# EasyEDA Pro project ProPrj_辅助电源_2024-09-12.epro

# Schematic Schematic1
Board Name: Board1; Create Date: 2024-09-10
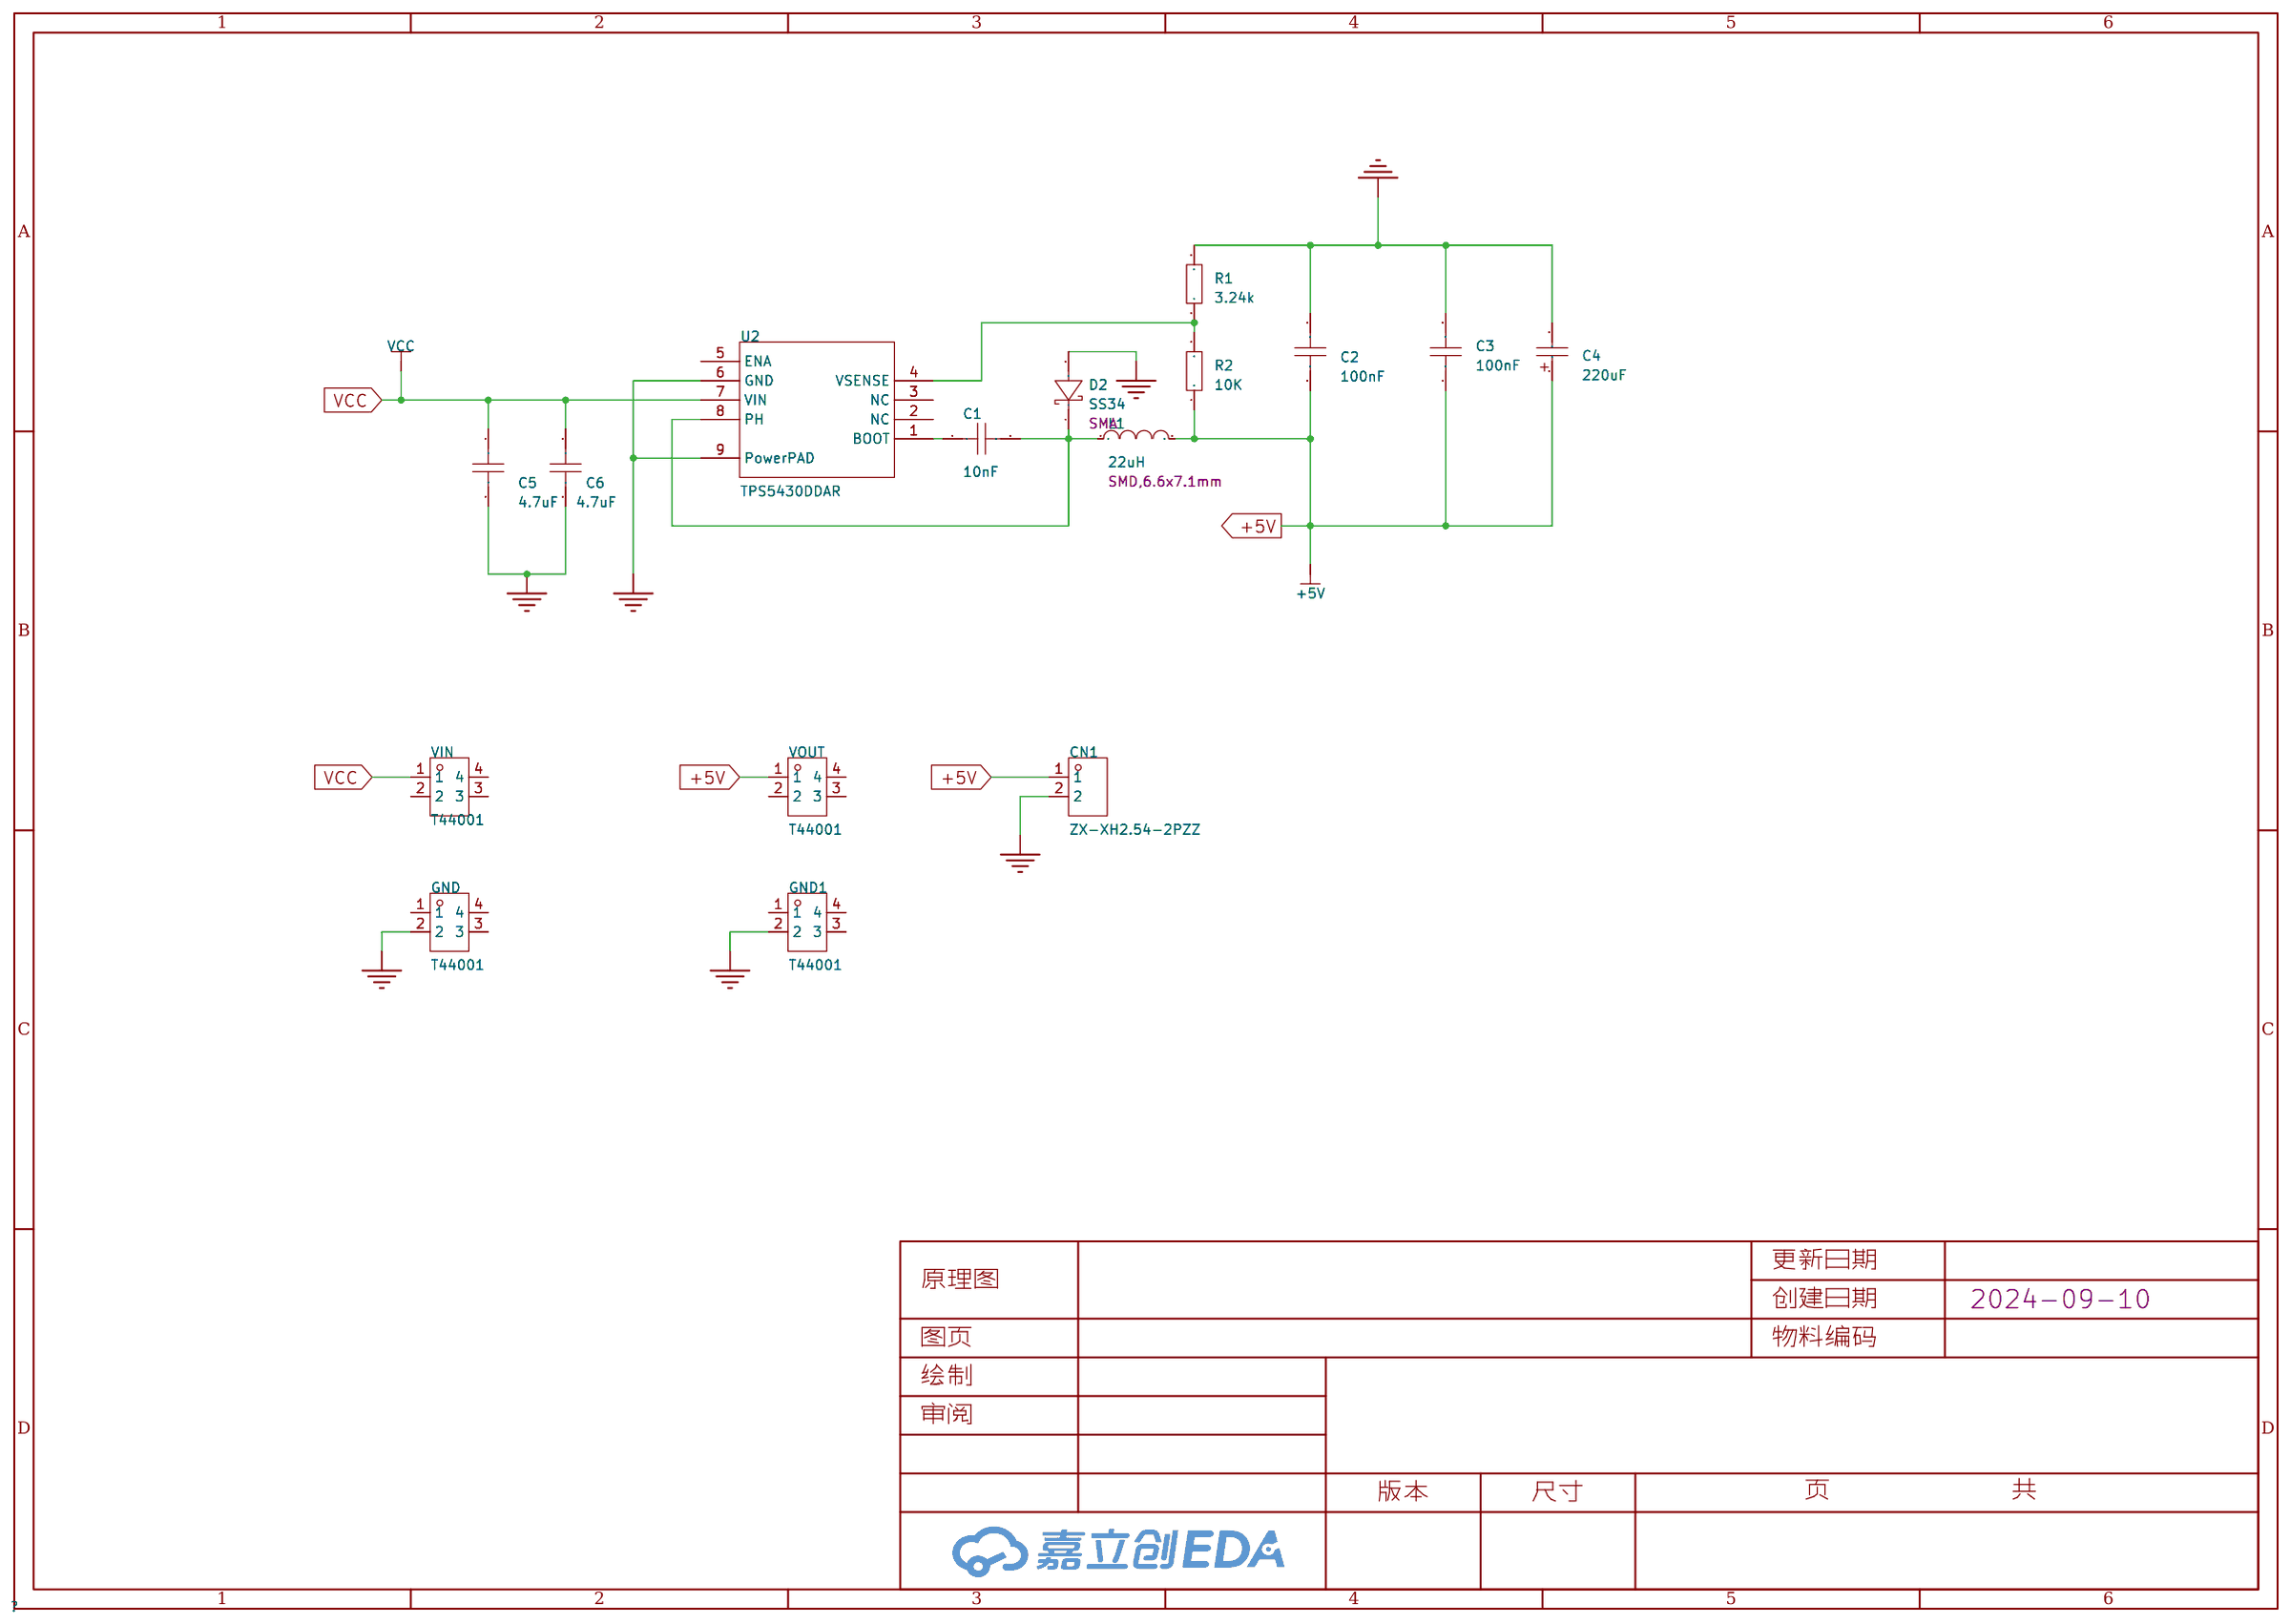
[diagram p0: schematic sheet]

## Parts
C1  10nF  [C0603]
C2  100nF  [C0603]
C3  100nF  [C0603]
C4  220uF  [C_Ele_SMD_3x5.4mm]
C5  4.7uF  [C0603]
C6  4.7uF  [C0603]
CN1  ZX-XH2.54-2PZZ  [CONN-TH_2P-P2.50_HX25003-2A]
D2  SS34  [SMA_L4.3-W2.7-LS5.0-RD]
GND  T44001  [CONN-TH_T44001]
GND1  T44001  [CONN-TH_T44001]
L1  22uH  [IND-SMD_L7.1-W6.6]
R1  3.24k  [R0603]
R2  10K  [R0603]
U2  TPS5430DDAR  [ESOP-8_L4.9-W3.9-P1.27-LS6.0-TL-EP]
VIN  T44001  [CONN-TH_T44001]
VOUT  T44001  [CONN-TH_T44001]

## Library data of the parts
C1-C3 C5 C6 = CAP_0603: Supplier Footprint: 0603
C4 = C_Ele_SMD_3x5.4mm: Supplier Footprint: SMD,3x5.4mm
CN1 = ZX-XH2.54-2PZZ: 插针结构:1x2P;间距:2.54mm;安装方式:直插;参考系列:XH;总PIN数:2P;排数:1;每排PIN数:2;行距:-;额定电流:3A;触头材质:黄铜;触头镀层:锡;工作温度范围:-25℃~+85℃;; Supplier Part: C7429632; Manufacturer: Megastar(兆星); Supplier Footprint: 插件,P=2.54mm; Datasheet: https://atta.szlcsc.com/upload/public/pdf/source/20230619/19BA6947230AA44A04D3EDD65E618FD0.pdf; Supplier: LCSC; Pins Structure: 1x2P; Pitch: 2.54mm; Mounting Style: 直插; Reference Series: XH; Number of Pins: 2P; Number of Rows: 1; Number of PINs Per Row: 2; Current Rating (Max): 3A; Contact Material: 黄铜; Contact Plating: 锡; Operating Temperature Range: -25℃~+85℃
D2 = SS34_C9900017801: 二极管配置:独立式;正向压降(Vf):550mV@3A;直流反向耐压(Vr):40V;整流电流:3A;; Supplier Part: C9900017801; Manufacturer: MDD(辰达半导体); Supplier Footprint: SMA; JLCPCB Part Class: Extended Part; Datasheet: https://atta.szlcsc.com/upload/public/pdf/source/20230314/A80AE34493C69B89E2F4B1712F433538.pdf; Supplier: LCSC; Diode Configuration: 独立式; Forward Voltage (Vf@If): 550mV@3A; Reverse Voltage (Vr): 40V; Rectified Current: 3A; Reverse Leakage Current (Ir): 500uA@40V
GND GND1 VIN VOUT = T44001: LCSC Part Name: 四脚 M4 二件套; Supplier Part: C481447; Manufacturer: XFCN(兴飞); Supplier Footprint: 插件; Datasheet: https://atta.szlcsc.com/upload/public/pdf/source/20200107/C481448_4214B4EB74A46B70BD82BA8A456D4EDD.pdf; Supplier: LCSC
L1 = YSPI0630A-220M: 电感值:22uH;精度:±20%;额定电流:3A;; LCSC Part Name: 22uH ±20%; Supplier Part: C497873; Manufacturer: YJYCOIN(益嘉源); Supplier Footprint: SMD,6.6x7.1mm; JLCPCB Part Class: Extended Part; Datasheet: https://atta.szlcsc.com/upload/public/pdf/source/20200317/C497869_D09F597887D5FB8B541C5C98B400E286.pdf; Supplier: LCSC; Tolerance: ±20%; Rated Current: 3A; DC Resistance (DCR): 130mΩ; Saturation Current (Isat): 18A; Type: 一体成型电感
R1 R2 = Res_0603: Supplier Footprint: 0603
U2 = TPS5430DDAR: 功能类型:降压型;输出类型:可调;输入电压:5.5V~36V;输出电压:1.221V~32.04V;输出电流(最大值):3A;; LCSC Part Name: 降压 3A 36V; Supplier Part: C9864; Manufacturer: TI(德州仪器); Supplier Footprint: SOIC-8-EP; JLCPCB Part Class: 基础库; Datasheet: https://www.ti.com/cn/lit/gpn/tps5430; Supplier: LCSC; Function: 降压型; Output Type: 可调; Input Voltage: 5.5V~36V; Output Voltage: 1.221V~32.04V; Output Current (Max): 3A; Switching Frequency: 500kHz; Operating Temperature: -40℃~+125℃@(TJ); Synchronous Rectification: 否; Number of Outputs: 1; Topology: 降压式; Switch tube (built-in/external): 内置

## Nets
+5V: C2.2 C3.1 C4.1 CN1.1 L1.2 R2.1 VOUT.1
GND: C2.1 C3.2 C4.2 C5.2 C6.2 CN1.2 D2.2(K) GND.2 GND1.2 R1.2 U2.6(GND) U2.9(PowerPAD)
VCC: C5.1 C6.1 U2.7(VIN) VIN.1
$1N684: C1.1 U2.1(BOOT)
$1N688: R1.1 R2.2 U2.4(VSENSE)
$1N1035: C1.2 D2.1(A) L1.1 U2.8(PH)

Not connected (* = marked no-connect by the designer): GND 1 3 4; GND1 1 3 4; U2 2(NC) 3(NC) 5(ENA); VIN 2 3 4; VOUT 2 3 4

# Board PCB1
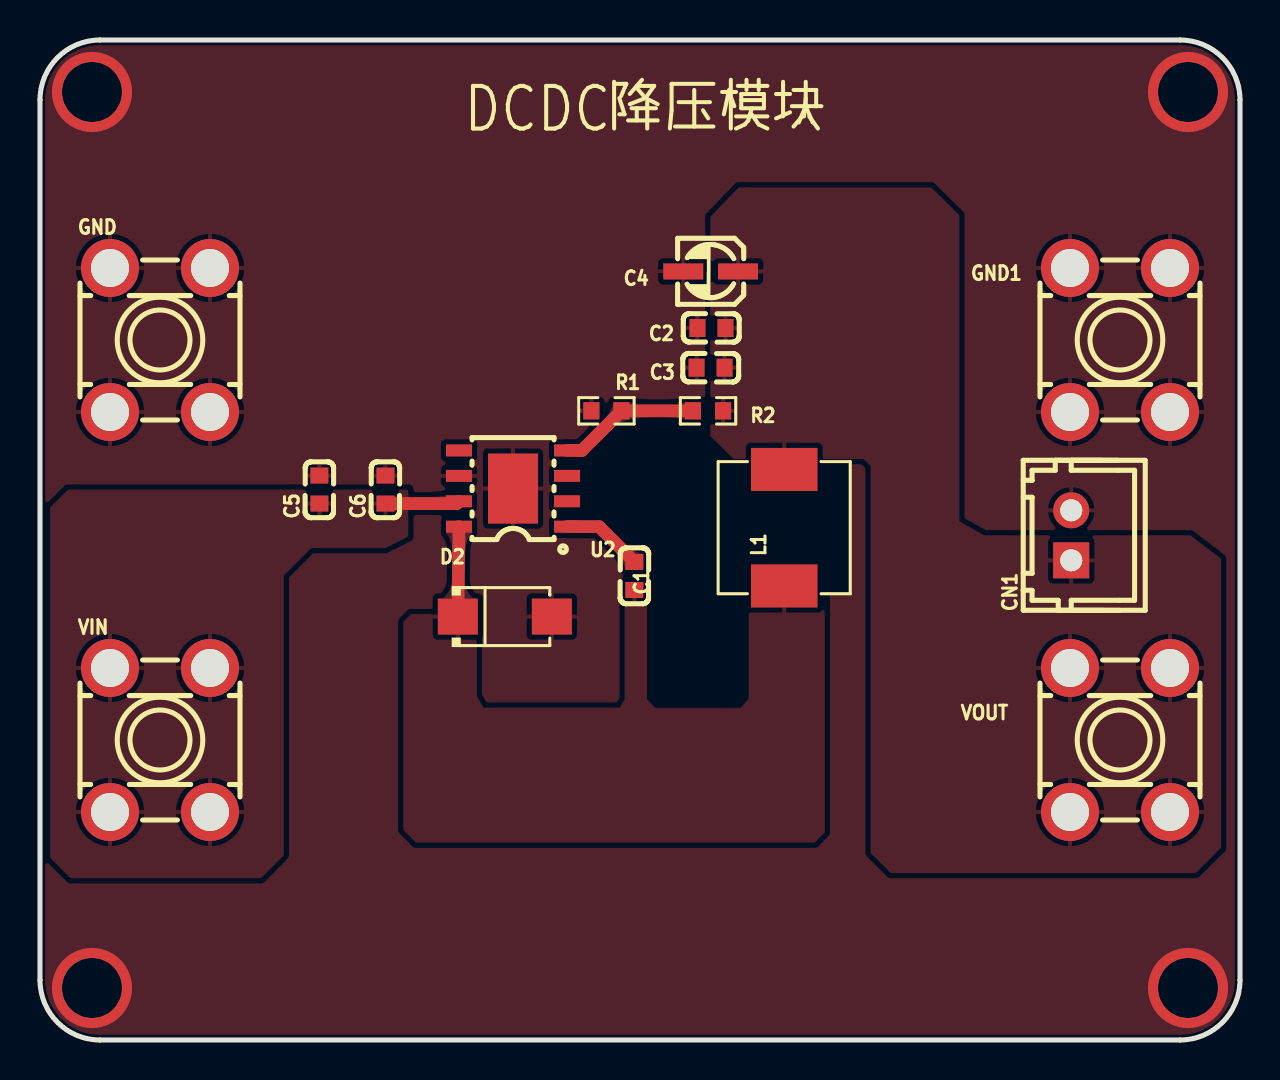
[diagram p1: board, top side]
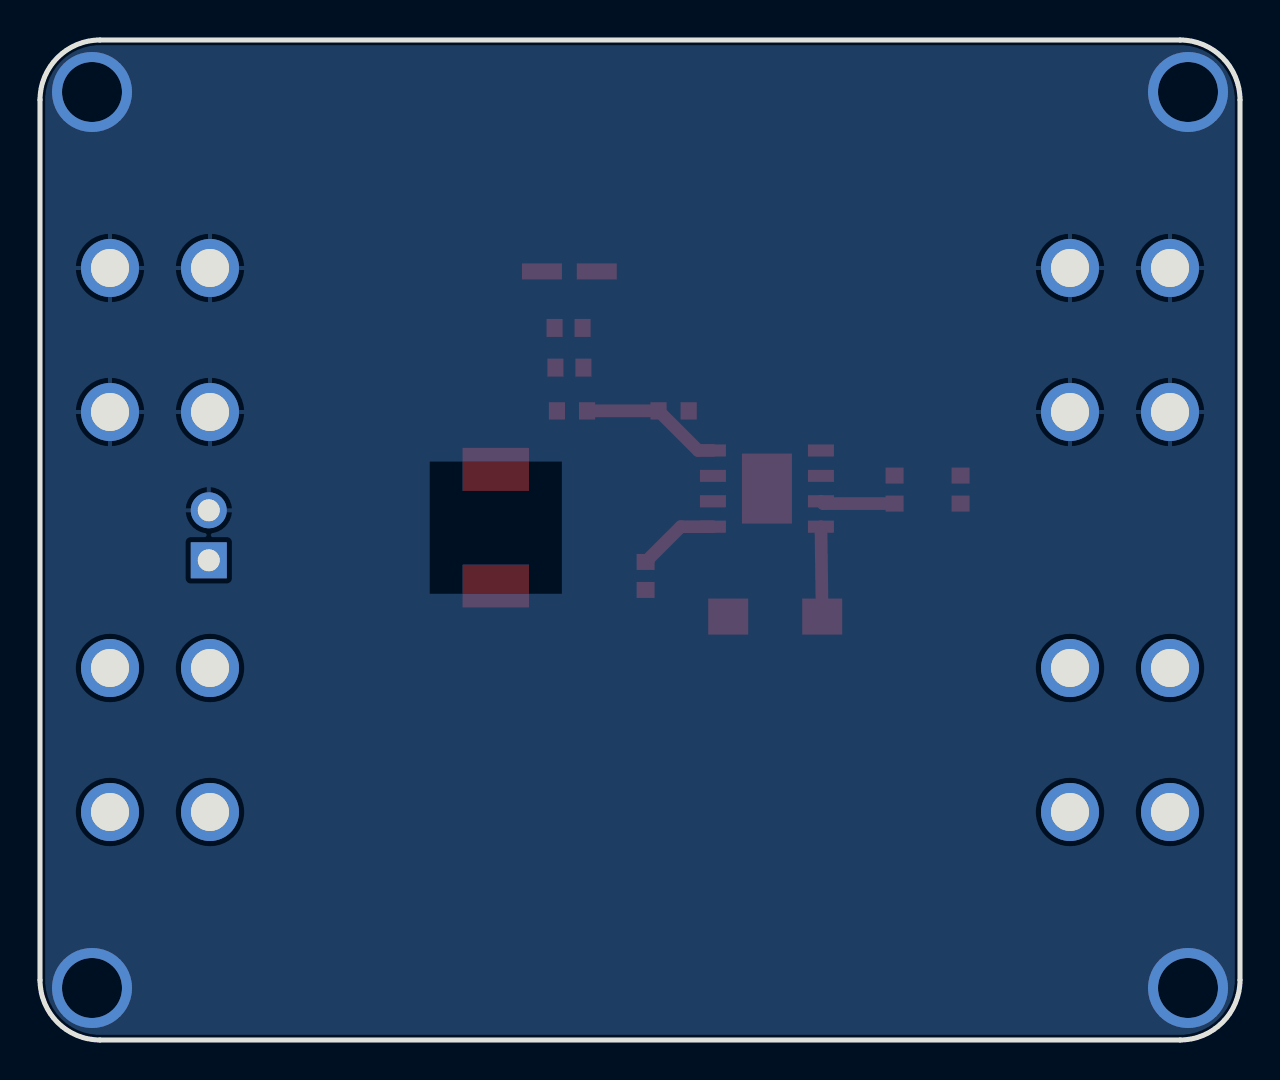
[diagram p2: board, bottom side, seen from below]

Outline 60 x 50 mm; copper layers: Top Layer, Bottom Layer. Coordinates in mm from the lower left corner of the outline.
Outline path: 0,47 0,3 arc(0.88,0.88) 3,0 57,0 arc(59.12,0.88) 60,3 60,47 arc(59.12,49.12) 57,50 3,50 arc(0.88,49.12) 0,47
Stack: Top Layer 0.035mm / Dielectric1 1.51mm FR4 er 4.5 / Bottom Layer 0.035mm

## Design rules (mm)
template: 自定义配置
spacing copperThickness1oz (default): track to track 0.102, other pairs 0.152 to 0.3
spacing copperThickness2oz: track to track 0.203, other pairs 0.152 to 0.3
track width copperThickness1oz (default): min 0.127, default 0.635, max 2.54
track width copperThickness2oz: min 0.203, default 0.254, max 2.54
differential pair differentialPair (default): width min 0.127, default 0.254, max 2.54; gap min 0.152, default 0.152
via viaSize (default): diameter min 0.5, default 0.61, max 10; hole min 0.3, default 0.305, max 6.3

## Placement (name value [footprint] x y rotation side)
C1  10nF  [C0603]  29.72 23.2 270 top
C2  100nF  [C0603]  33.57 35.6 0 top
C3  100nF  [C0603]  33.53 33.62 180 top
C4  220uF  [C_Ele_SMD_3x5.4mm]  33.53 38.44 0 top
C5  4.7uF  [C0603]  13.97 27.52 90 top
C6  4.7uF  [C0603]  17.27 27.52 90 top
CN1  ZX-XH2.54-2PZZ  [CONN-TH_2P-P2.50_HX25003-2A]  51.56 25.23 90 top
D2  SS34  [SMA_L4.3-W2.7-LS5.0-RD]  23.24 21.17 0 top
GND  T44001  [CONN-TH_T44001]  6 35 0 top
GND1  T44001  [CONN-TH_T44001]  54 35 0 top
L1  22uH  [IND-SMD_L7.1-W6.6]  37.21 25.62 90 top
R1  3.24k  [R0603]  28.32 31.46 180 top
R2  10K  [R0603]  33.4 31.46 180 top
U2  TPS5430DDAR  [ESOP-8_L4.9-W3.9-P1.27-LS6.0-TL-EP]  23.65 27.57 180 top
VIN  T44001  [CONN-TH_T44001]  6 15 0 top
VOUT  T44001  [CONN-TH_T44001]  54 15 0 top

## Footprints (pads in the part's own frame, mm; a bottom-side part is the same pattern mirrored in y, then rotated)
C0603
  rect 0.8x0.9 smd: 1(-0.7,0) 2(0.7,0)
C_Ele_SMD_3x5.4mm
  rect 1.999x0.8 smd: 1(1.374,-0.014) 2(-1.364,-0.014)
CONN-TH_2P-P2.50_HX25003-2A
  rect 1.8x1.8 hole 1.1: 1(-1.25,0)
  round 1.8 hole 1.1: 2(1.25,0)
CONN-TH_T44001
  round 2.9 hole 1.9: 1(-2.5,3.6) 2(-2.5,-3.6) 3(2.5,-3.6) 4(2.5,3.6)
ESOP-8_L4.9-W3.9-P1.27-LS6.0-TL-EP
  rect 1.3x0.6 smd: 1(-2.7,1.905) 2(-2.7,0.635) 3(-2.7,-0.635) 4(-2.7,-1.905) 5(2.7,-1.905) 6(2.7,-0.635) 7(2.7,0.635) 8(2.7,1.905)
  rect 2.5x3.5 smd: 9(0,0)
IND-SMD_L7.1-W6.6
  rect 2.15x3.32 smd: 1(-2.913,0) 2(2.913,0)
R0603
  rect 0.806x0.864 smd: 1(-0.753,0) 2(0.753,0)
SMA_L4.3-W2.7-LS5.0-RD
  rect 2x1.8 smd: 1(-2.35,0) 2(2.35,0)

## Nets
+5V: C2.2 C3.1 C4.1 CN1.1 L1.2 R2.1 VOUT.1 VOUT.2 VOUT.3 VOUT.4
GND: C2.1 C3.2 C4.2 C5.2 C6.2 CN1.2 D2.2 GND.1 GND.2 GND.3 GND.4 GND1.1 GND1.2 GND1.3 GND1.4 R1.2 U2.6 U2.9
VCC: C5.1 C6.1 U2.7 VIN.1 VIN.2 VIN.3 VIN.4
$1N684: C1.1 U2.1
$1N688: R1.1 R2.2 U2.4
$1N1035: C1.2 D2.1 L1.1 U2.8

Pads without a net: U2 2 3 5

## Via types
v1: diameter 4, hole 3, Top Layer to Bottom Layer, 4 vias

## Routing (per net, layer and track width the routed paths; a pad name or vN(x,y) marks a point on that pad's centre or on a via; arc(x,y) is an arc through that point)
GND:
  vias: v1(2.6,47.4) v1(2.6,2.6) v1(57.4,47.4) v1(57.4,2.6)
VCC: length 3.7
  Top Layer w0.635: U2.7 20.84,26.82 C6.1
$1N684: length 4.1
  Top Layer w0.635: C1.1 27.96,25.67 U2.1
$1N688: length 7.1
  Top Layer w0.635: U2.4 27.09,29.48 R1.1 R2.2
$1N1035: length 4.5
  Top Layer w0.635: D2.1 U2.8

## Copper pours and planes (outline as drawn; the poured copper is in the pictures)
+5V on Top Layer: 33.51,30.2 34.67,29.05 41.18,29.05 41.53,28.69 41.53,9.36 42.54,8.34 57.78,8.34 59.06,9.61 59.06,24.07 57.52,25.23 47.22,25.23 45.97,25.93 45.97,41.24 44.56,42.63 34.93,42.63 33.51,41.16
GND on Top Layer: -6.98,53.81 66.42,53.81 66.42,-4.86 -6.98,-4.86
GND on Bottom Layer: -14.61,58.76 89.79,58.76 89.79,-17.56 -14.61,-17.56
VCC on Top Layer: 0.51,26.63 0.51,9.11 1.52,8.09 11.05,8.09 12.19,9.23 12.19,23.23 13.56,24.6 17.28,24.6 18.41,25.17 18.41,27.52 1.4,27.52
$1N1035 on Top Layer: 21.52,21.3 21.84,20.97 21.84,17.2 22.17,16.62 28.99,16.62 29.23,17.05 29.23,22.72 29.34,22.82 30.23,22.82 30.35,22.69 30.35,17.04 30.77,16.6 35.03,16.6 35.43,17.07 35.43,22.06 35.56,22.19 39.12,22.19 39.24,22.06 39.24,10.38 38.74,9.87 18.8,9.87 18.16,10.5 18.16,20.92 18.54,21.3

Small or netless copper shapes (teardrops, artwork), in the pictures only: 8 on Top Layer

## Text on the board
Top Silkscreen Layer: DCDC降压模块
